# Altium project PCB.PrjPcb
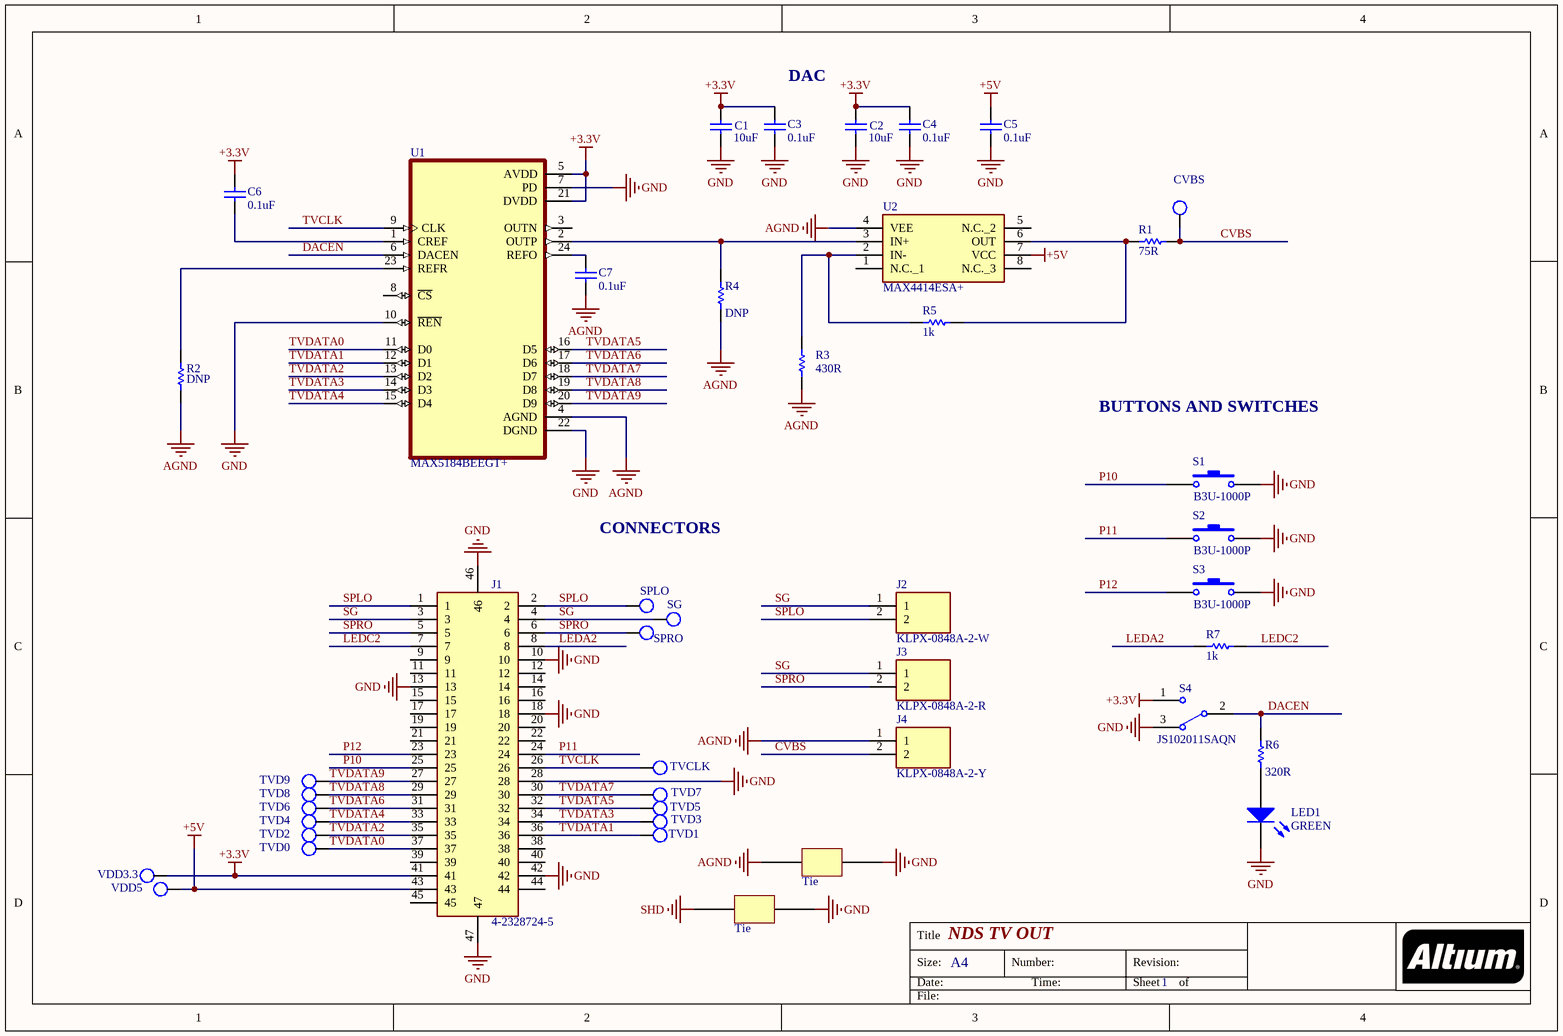
[diagram p0: Schematic.SchDoc]
1 sheet, 44 parts. Net scope: global (net labels, ports and power ports of the same name join across sheets).
Board file: PCB.PcbDoc

## Sheet Schematic.SchDoc: NDS TV OUT
size A4; SheetNumber: 1

### Parts
C1  10uF  [CAPC2012X90N]
C2  10uF  [CAPC2012X90N]
C3  0.1uF  [CAPC2012X90N]
C4  0.1uF  [CAPC2012X90N]
C5  0.1uF  [CAPC2012X90N]
C6  0.1uF  [CAPC2012X90N]
C7  0.1uF  [CAPC2012X90N]
CVBS  (no value)  [Test_Point]
J1  4-2328724-5  [423287245]
J2  KLPX-0848A-2-W  [KLPX0848A2RG]
J3  KLPX-0848A-2-R  [KLPX0848A2RG]
J4  KLPX-0848A-2-Y  [KLPX0848A2RG]
LED1  GREEN  [LED_OSRAM_LOR976]
R1  value 75R  [RESC2012X50N]  (hidden comment: Res1)
R2  value DNP  [RESC2012X50N]  (hidden comment: Res1)
R3  value 430R  [RESC2012X50N]  (hidden comment: Res1)
R4  value DNP  [RESC2012X50N]  (hidden comment: Res1)
R5  value 1k  [RESC2012X50N]  (hidden comment: Res1)
R6  value 320R  [RESC2012X50N]  (hidden comment: Res1)
R7  value 1k  [RESC2012X50N]  (hidden comment: Res1)
S1  B3U-1000P  [B3U-1000P]
S2  B3U-1000P  [B3U-1000P]
S3  B3U-1000P  [B3U-1000P]
S4  JS102011SAQN  [JS102011SAQN]
SG  (no value)  [Test_Point]
SPLO  (no value)  [Test_Point]
SPRO  (no value)  [Test_Point]
Tie1  Tie  [Tie]
Tie2  Tie  [Tie]
TVCLK  (no value)  [Test_Point]
TVD0  (no value)  [Test_Point]
TVD1  (no value)  [Test_Point]
TVD2  (no value)  [Test_Point]
TVD3  (no value)  [Test_Point]
TVD4  (no value)  [Test_Point]
TVD5  (no value)  [Test_Point]
TVD6  (no value)  [Test_Point]
TVD7  (no value)  [Test_Point]
TVD8  (no value)  [Test_Point]
TVD9  (no value)  [Test_Point]
U1  MAX5184BEEGT+  [SOP63P602X175-24N]
U2  MAX4414ESA+  [SOIC127P600X175-8N]
VDD3.3  (no value)  [Test_Point]
VDD5  (no value)  [Test_Point]

### Nets
+3.3V: C1.1 C2.1 C3.1 C4.1 C6.1 J1.41 S4.1 U1.5(AVDD) U1.21(DVDD) VDD3.3.1
+5V: C5.1 J1.43 U2.7(VCC) VDD5.1
AGND: C7.2 J4.1 R2.1 R3.1 R4.1 Tie1.1 U1.4(AGND) U2.4(VEE)
GND: C1.2 C2.2 C3.2 C4.2 C5.2 J1.10 J1.13 J1.18 J1.28 J1.42 J1.46 J1.47 LED1.2(K) S1.2 S2.2 S3.2 S4.3 Tie1.2 Tie2.2 U1.7(PD) U1.10(~{REN}) U1.22(DGND)
SHD: Tie2.1
CVBS: CVBS.1 J4.2 R1.1
DACEN: R6.2 S4.2 U1.6(DACEN)
LEDA2: J1.8 R7.2
LEDC2: J1.7 R7.1
P10: J1.25 S1.1
P11: J1.24 S2.1
P12: J1.23 S3.1
SG: J1.3 J1.4 J2.1 J3.1 SG.1
SPLO: J1.1 J1.2 J2.2 SPLO.1
SPRO: J1.5 J1.6 J3.2 SPRO.1
TVCLK: J1.26 TVCLK.1 U1.9(CLK)
TVDATA0: J1.37 TVD0.1 U1.11(D0)
TVDATA1: J1.36 TVD1.1 U1.12(D1)
TVDATA2: J1.35 TVD2.1 U1.13(D2)
TVDATA3: J1.34 TVD3.1 U1.14(D3)
TVDATA4: J1.33 TVD4.1 U1.15(D4)
TVDATA5: J1.32 TVD5.1 U1.16(D5)
TVDATA6: J1.31 TVD6.1 U1.17(D6)
TVDATA7: J1.30 TVD7.1 U1.18(D7)
TVDATA8: J1.29 TVD8.1 U1.19(D8)
TVDATA9: J1.27 TVD9.1 U1.20(D9)
NetC6_2: C6.2 U1.1(CREF)
NetC7_1: C7.1 U1.24(REFO)
NetLED1_1: LED1.1(A) R6.1
NetR1_2: R1.2 R5.1 U2.6(OUT)
NetR2_2: R2.2 U1.23(REFR)
NetR3_2: R3.2 R5.2 U2.2(IN-)
NetR4_2: R4.2 U1.2(OUTP) U2.3(IN+)

Not connected (* = marked no-connect by the designer): J1 9 11 12 14 15 16 17 19 20 21 22 38 39 40 44 45; U1 3(OUTN) 8(~{CS}); U2 1(N.C._1) 5(N.C._2) 8(N.C._3)

### Notes on the sheet
- DAC
- BUTTONS AND SWITCHES
- CONNECTORS
- Title
- Size:
- Date:
- A4
- Number:
- Time:
- Revision:
- Sheet
- of
- File:

### Library data of the parts
C1-C7 = Cap: Capacitor; Published: 8-Jun-2000; LatestRevisionDate: 17-Jul-2002; LatestRevisionNote: Re-released for DXP Platform.; PackageReference: RAD-0.3; Publisher: Altium Limited; PackageDescription: Radial Cap, Thru-Hole; 2 Leads; 0.3 in Pin Spacing
  C1 C2: Value: 10uF
  C3-C7: Value: 0.1uF
CVBS SG SPLO SPRO TVCLK TVD0-TVD9 VDD3.3 VDD5 = TP_P0_0.8_D0: Test Point
J1 = 4-2328724-5: Connector; Manufacturer_Name: TE Connectivity; Datasheet Link: https://www.te.com/commerce/DocumentDelivery/DDEController?Action=showdoc&DocId=Customer+Drawing%7F2328724%7F3%7Fpdf%7FEnglish%7FENG_CD_2328724_3.pdf%7F4-2328724-5; Height: 1.1mm; Manufacturer_Part_Number: 4-2328724-5; Mouser Part Number: 571-4-2328724-5; Mouser Price/Stock: https://www.mouser.co.uk/ProductDetail/TE-Connectivity/4-2328724-5/?qs=w%2Fv1CP2dgqow3y3efq3sig%3D%3D; Arrow Part Number: 4-2328724-5; Arrow Price/Stock: https://www.arrow.com/en/products/4-2328724-5/te-connectivity
J2-J4 = KLPX-0848A-2-R-G: Connector; Manufacturer_Name: Kycon; Datasheet Link: http://pdf.datasheet.su/kycon/klpx-0848a-2-o.pdf; Height: 13mm; Manufacturer_Part_Number: KLPX-0848A-2-R-G; Mouser Part Number: 806-KLPX-0848A-2RG; Mouser Price/Stock: https://www.mouser.co.uk/ProductDetail/Kycon/KLPX-0848A-2-R-G?qs=OD9TCanM70Aq6%252BNVnl7Mvg%3D%3D
LED1 = LED0: LED GREEN CLEAR 0603 SMD; MANUFACTURER: Lite-On Inc.; Manufacturer PN: LTST-C191KRKT; Published: 8-Jun-2000; PackageReference: LED-0; Publisher: Altium Limited; PackageDescription: LED; 2 Leads
R1-R7 = Res1: Resistor; Published: 8-Jun-2000; LatestRevisionDate: 17-Jul-2002; LatestRevisionNote: Re-released for DXP Platform.; PackageReference: AXIAL-0.3; Publisher: Altium Limited; PackageDescription: Axial Device, Thru-Hole; 2 Leads; 0.3 in Pin Spacing
S1-S3 = SW-PB: Switch; Published: 24-Mar-1999; LatestRevisionDate: 17-Jul-2002; LatestRevisionNote: Re-released for DXP Platform.; PackageReference: SPST-2; Publisher: Altium Limited; PackageDescription: Switch; 2 Leads
S4 = SW-SPDT: SPDT Subminiature Toggle Switch, Right Angle Mounting, Vertical Actuation
U1 = MAX5184BEEGT: Package: None; Price: None; Value: *; MP: MAX5184BEEGT; Availability: Unavailable
U2 = MAX4414ESA+: Integrated Circuit; Manufacturer_Name: Maxim Integrated; Datasheet Link: https://datasheet.datasheetarchive.com/originals/dk/DKDS-7/136984.pdf; Height: 1.75mm; Manufacturer_Part_Number: MAX4414ESA+; Mouser Part Number: 700-MAX4414ESA; Mouser Price/Stock: https://www.mouser.co.uk/ProductDetail/Maxim-Integrated/MAX4414ESA%2b?qs=1eQvB6Dk1vgudhnIKtrMFQ%3D%3D